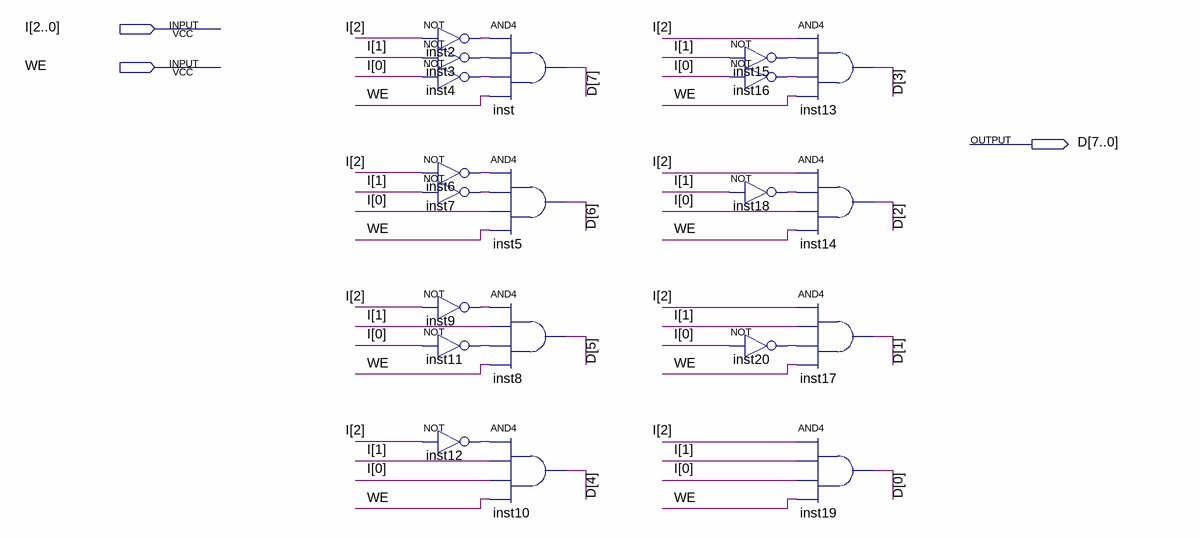
[diagram p0: schematic sheet]
// Quartus schematic decoder3_8.bdf as structural Verilog: 20 symbols, 3 pins
module decoder3_8 (
  input  [2:0] I,
  input  WE,
  output [7:0] D
);

  wire inst2_out, inst3_out, inst4_out, inst6_out, inst7_out, inst9_out, inst11_out, inst12_out, inst15_out,
       inst16_out, inst18_out, inst20_out;

  not inst2 (inst2_out, I[2]);
  not inst3 (inst3_out, I[1]);
  not inst4 (inst4_out, I[0]);
  not inst6 (inst6_out, I[2]);
  not inst7 (inst7_out, I[1]);
  not inst9 (inst9_out, I[2]);
  not inst11 (inst11_out, I[0]);
  not inst12 (inst12_out, I[2]);
  and inst (D[7], inst2_out, inst3_out, inst4_out, WE);
  and inst5 (D[6], inst6_out, inst7_out, I[0], WE);
  and inst8 (D[5], inst9_out, I[1], inst11_out, WE);
  and inst10 (D[4], inst12_out, I[1], I[0], WE);
  not inst15 (inst15_out, I[1]);
  not inst16 (inst16_out, I[0]);
  not inst18 (inst18_out, I[1]);
  not inst20 (inst20_out, I[0]);
  and inst13 (D[3], I[2], inst15_out, inst16_out, WE);
  and inst14 (D[2], I[2], inst18_out, I[0], WE);
  and inst17 (D[1], I[2], I[1], inst20_out, WE);
  and inst19 (D[0], I[2], I[1], I[0], WE);
endmodule
